# Altium schematic sheet Cycle-Controller-Onboard.SchDoc: RespiraWorks
size A3; CompanyName: RespiraWorks; DrawnBy: E. Chiu; Organization: Altium; DocumentNumber: 4; Revision: A1; SheetNumber: 4; SheetTotal: 8; PageSetup: Record=PageOptions|CenterHorizontal=True|CenterVertical=True|PrintScale=0.67|XCorrection=1.00|YCorrection=1.00|PrintKind=0|BorderSize=5000000|LeftOffset=0|BottomOffset=0|Orientation=2|PaperLength=1000|PaperWidth=1000|Scale=100|PaperSource=276|PrintQuality=-3|MediaType=1|DitherType=10|PrintScaleMode=1|PaperKind=11"x17" 279.4x431.8mm|PaperIndex=3; ProjectName: FALCON 3S
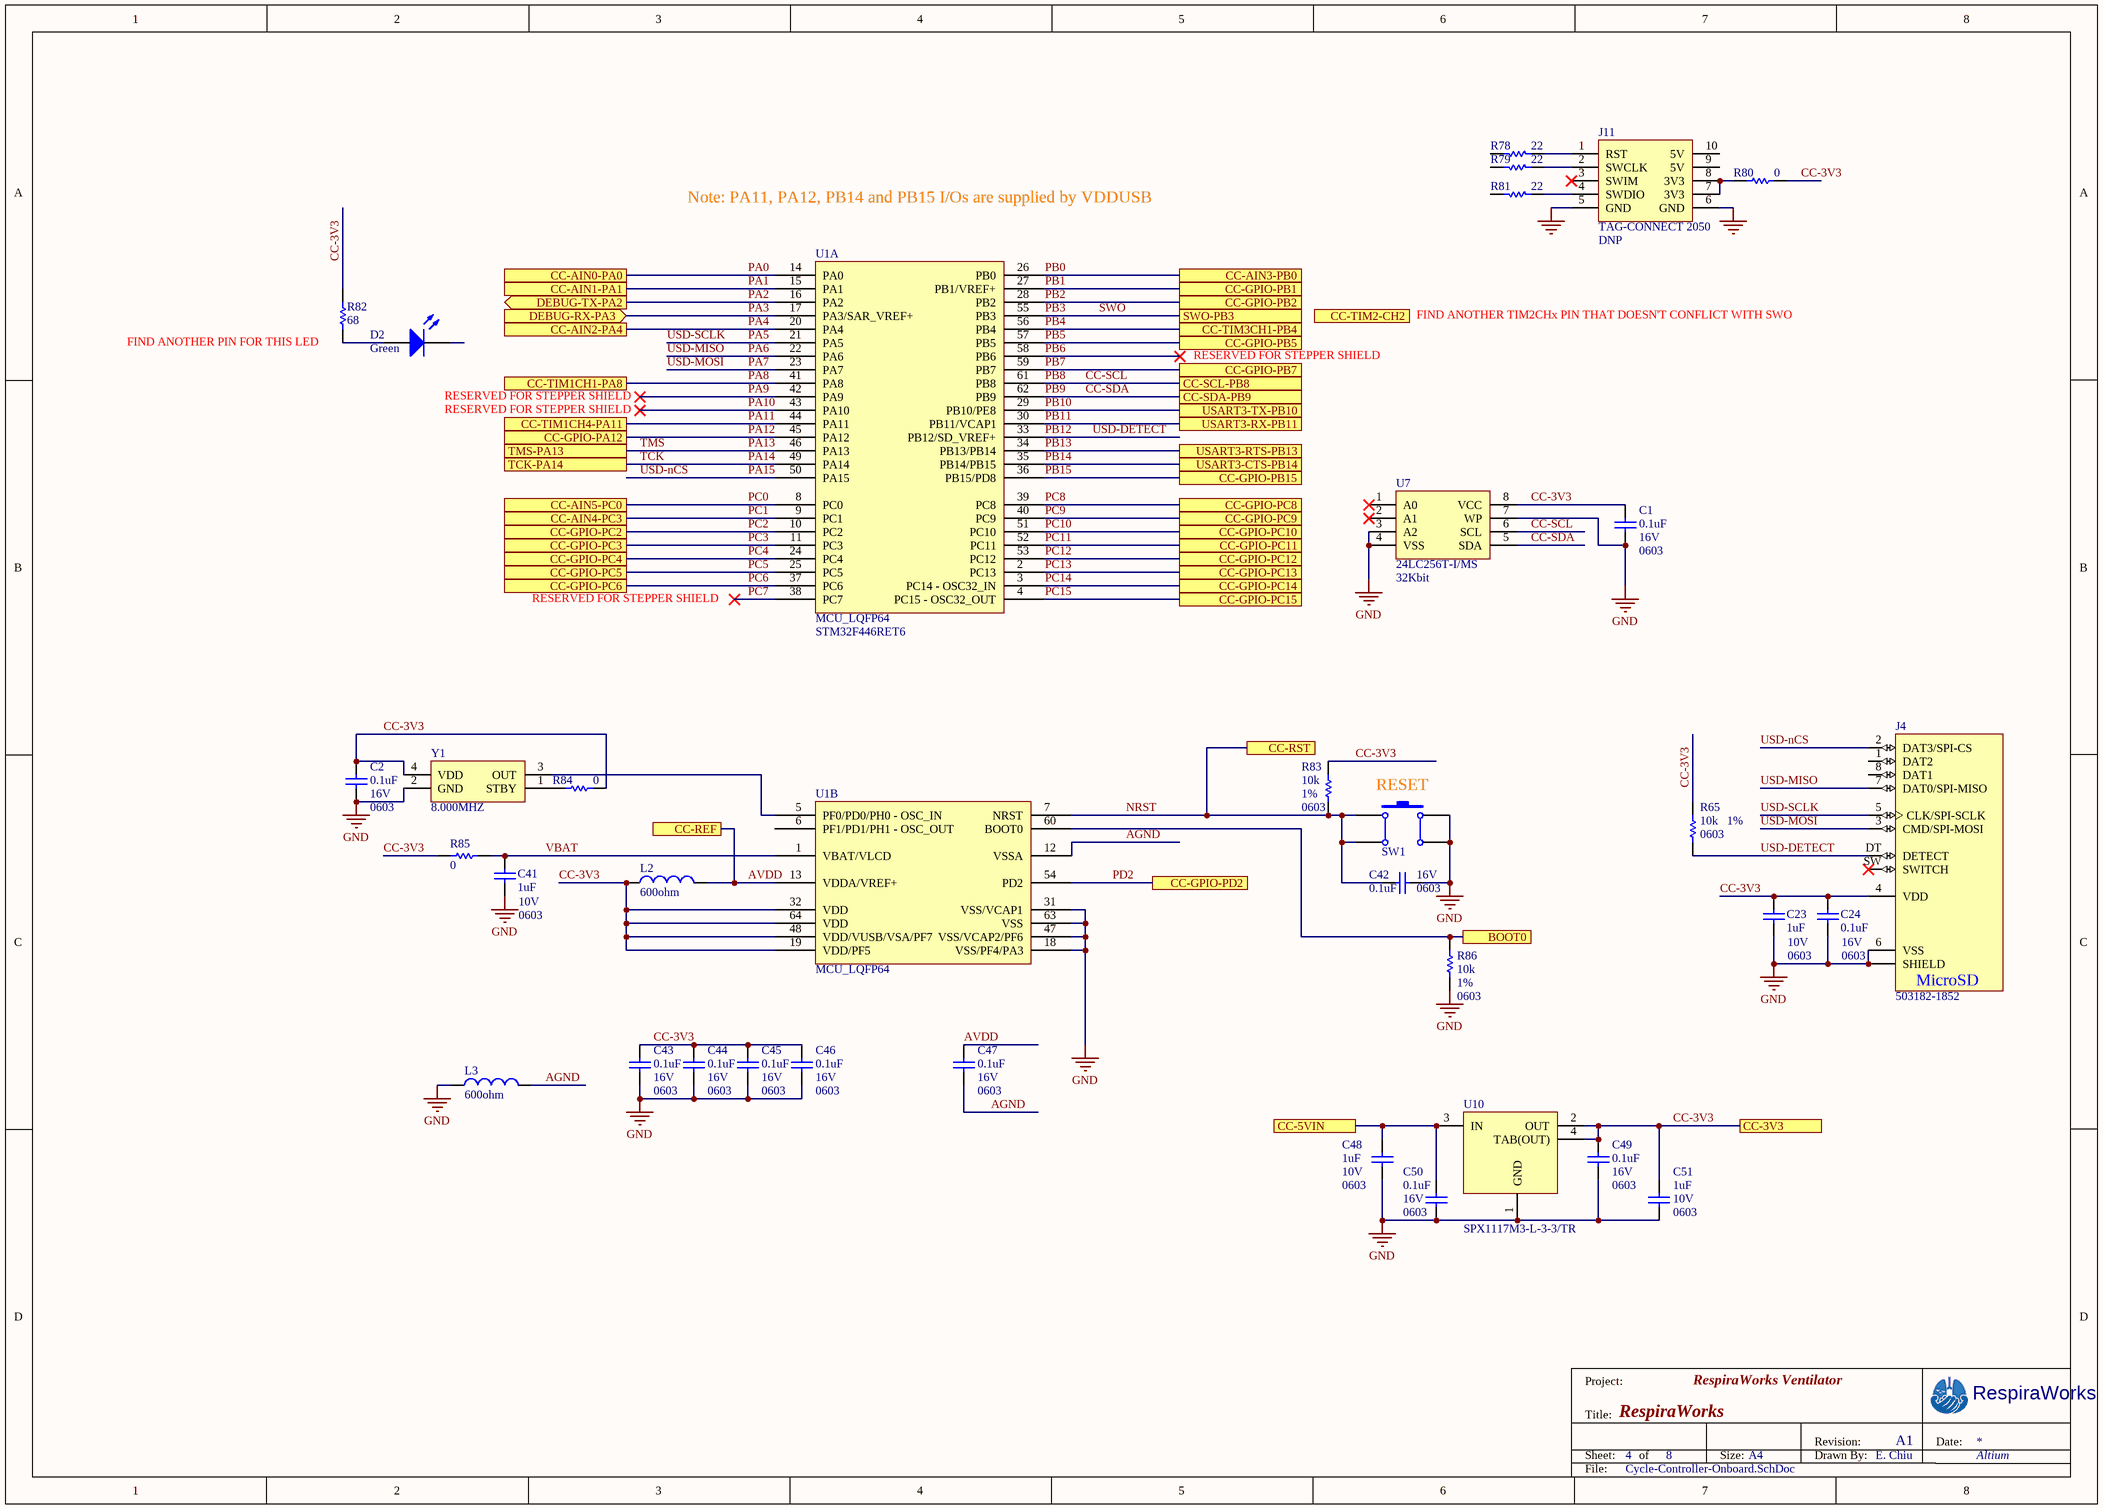
[diagram p0: Cycle-Controller-Onboard.SchDoc]

## Parts
C1  value 0.1uF  Voltage: 16V  PCB Package: 0603  [CAP0603]  (hidden comment: CAP 0603)
C2  value 0.1uF  Voltage: 16V  PCB Package: 0603  [CAP0603]  (hidden comment: CAP 0603)
C23  value 1uF  Voltage: 10V  PCB Package: 0603  [CAP0603]  (hidden comment: CAP 0603)
C24  value 0.1uF  Voltage: 16V  PCB Package: 0603  [CAP0603]  (hidden comment: CAP 0603)
C41  value 1uF  Voltage: 10V  PCB Package: 0603  [CAP0603]  (hidden comment: CAP 0603)
C42  value 0.1uF  Voltage: 16V  PCB Package: 0603  [CAP0603]  (hidden comment: CAP 0603)
C43  value 0.1uF  Voltage: 16V  PCB Package: 0603  [CAP0603]  (hidden comment: CAP 0603)
C44  value 0.1uF  Voltage: 16V  PCB Package: 0603  [CAP0603]  (hidden comment: CAP 0603)
C45  value 0.1uF  Voltage: 16V  PCB Package: 0603  [CAP0603]  (hidden comment: CAP 0603)
C46  value 0.1uF  Voltage: 16V  PCB Package: 0603  [CAP0603]  (hidden comment: CAP 0603)
C47  value 0.1uF  Voltage: 16V  PCB Package: 0603  [CAP0603]  (hidden comment: CAP 0603)
C48  value 1uF  Voltage: 10V  PCB Package: 0603  [CAP0603]  (hidden comment: CAP 0603)
C49  value 0.1uF  Voltage: 16V  PCB Package: 0603  [CAP0603]  (hidden comment: CAP 0603)
C50  value 0.1uF  Voltage: 16V  PCB Package: 0603  [CAP0603]  (hidden comment: CAP 0603)
C51  value 1uF  Voltage: 10V  PCB Package: 0603  [CAP0603]  (hidden comment: CAP 0603)
D2  value Green  [LED0603]  (hidden comment: LED 0603)
J4  503182-1852  [503182-1852]
J11  TAG-CONNECT 2050  Do Not Populate: DNP  [TAG-CONNECT-2050]
L2  value 600ohm  [IND0603]  (hidden comment: BEAD)
L3  value 600ohm  [IND0603]  (hidden comment: BEAD)
R65  value 10k  PCB Package: 0603  Tolerance: 1%  [RES0603]  (hidden comment: RES 0603)
R78  value 22  [RES0603]  (hidden comment: RES 0603)
R79  value 22  [RES0603]  (hidden comment: RES 0603)
R80  value 0  [RES0603]  (hidden comment: RES 0603)
R81  value 22  [RES0603]  (hidden comment: RES 0603)
R82  value 68  [RES0603]  (hidden comment: RES 0603)
R83  value 10k  PCB Package: 0603  Tolerance: 1%  [RES0603]  (hidden comment: RES 0603)
R84  value 0  [RES0603]  (hidden comment: RES 0603)
R85  value 0  [RES0603]  (hidden comment: RES 0603)
R86  value 10k  PCB Package: 0603  Tolerance: 1%  [RES0603]  (hidden comment: RES 0603)
SW1  BUTTON  [PB-6MM-J-LEAD]  (value not drawn)
U1  MCU_LQFP64  Manufacturer P/N: STM32F446RET6  [64-LQFP]  (parts A,B of 2)
U7  value 32Kbit  [8-MSOP]  (hidden comment: 256Kbit)
U10  Manufacturer P/N: SPX1117M3-L-3-3/TR  [3-SOT223]  (hidden comment: NCP1117ST33T3G)
Y1  8.000MHZ  [4-OSC3225]

## Ports
BOOT0, CC-3V3, CC-5VIN, CC-AIN0-PA0, CC-AIN1-PA1, CC-AIN2-PA4, CC-AIN3-PB0, CC-AIN4-PC3, CC-AIN5-PC0, CC-GPIO-PA12, CC-GPIO-PB1, CC-GPIO-PB2, CC-GPIO-PB5, CC-GPIO-PB7, CC-GPIO-PB15, CC-GPIO-PC2, CC-GPIO-PC3, CC-GPIO-PC4, CC-GPIO-PC5, CC-GPIO-PC6, CC-GPIO-PC8, CC-GPIO-PC9, CC-GPIO-PC10, CC-GPIO-PC11, CC-GPIO-PC12, CC-GPIO-PC13, CC-GPIO-PC14, CC-GPIO-PC15, CC-GPIO-PD2, CC-REF, CC-RST, CC-SCL-PB8, CC-SDA-PB9, CC-TIM1CH1-PA8, CC-TIM1CH4-PA11, CC-TIM2-CH2, CC-TIM3CH1-PB4, DEBUG-RX-PA3 (in), DEBUG-TX-PA2 (out), SWO-PB3, TCK-PA14, TMS-PA13, USART3-CTS-PB14, USART3-RTS-PB13, USART3-RX-PB11, USART3-TX-PB10

## Nets
GND: C1.2 C2.2 C23.2 C24.2 C41.2 C42.2 C43.2 C44.2 C45.2 C46.2 C48.2 C49.2 C50.2 C51.2 J4.6(VSS) J4.P1(SHIELD) J4.P2(SHIELD) J4.P3(SHIELD) J4.P4(SHIELD) J4.P5(SHIELD) J11.5(GND) J11.6(GND) L3.1 R86.1 SW1.3 SW1.4 U1.18(VSS/PF4/PA3) U1.31(VSS/VCAP1) U1.47(VSS/VCAP2/PF6) U1.63(VSS) U7.3(A2) U7.4(VSS) U7.7(WP) U10.1(GND) Y1.2(GND)
AGND: C47.2 L3.2 U1.12(VSSA)
AVDD: C47.1 L2.2 U1.13(VDDA/VREF+) ; port CC-REF
BOOT0: R86.2 U1.60(BOOT0) ; port BOOT0
CC-3V3: C1.1 C2.1 C23.1 C24.1 C43.1 C44.1 C45.1 C46.1 C49.1 C51.1 J4.4(VDD) L2.1 R65.2 R80.2 R82.2 R83.2 R84.1 R85.2 U1.19(VDD/PF5) U1.32(VDD) U1.48(VDD/VUSB/VSA/PF7) U1.64(VDD) U7.8(VCC) U10.2(OUT) U10.4(TAB(OUT)) Y1.4(VDD) ; port CC-3V3
CC-5VIN: C48.1 C50.1 U10.3(IN) ; port CC-5VIN
CC-SCL: U1.61(PB8) U7.6(SCL) ; port CC-SCL-PB8  [also labelled PB8]
CC-SDA: U1.62(PB9) U7.5(SDA) ; port CC-SDA-PB9  [also labelled PB9]
NRST: C42.1 R83.1 SW1.1 SW1.2 U1.7(NRST) ; port CC-RST
PA0: U1.14(PA0) ; port CC-AIN0-PA0
PA1: U1.15(PA1) ; port CC-AIN1-PA1
PA2: U1.16(PA2) ; port DEBUG-TX-PA2
PA3: U1.17(PA3/SAR_VREF+) ; port DEBUG-RX-PA3
PA4: U1.20(PA4) ; port CC-AIN2-PA4
PA5: J4.5(CLK/SPI-SCLK) U1.21(PA5)  [also labelled USD-SCLK]
PA6: J4.7(DAT0/SPI-MISO) U1.22(PA6)  [also labelled USD-MISO]
PA7: J4.3(CMD/SPI-MOSI) U1.23(PA7)  [also labelled USD-MOSI]
PA8: U1.41(PA8) ; port CC-TIM1CH1-PA8
PA9: U1.42(PA9)
PA10: U1.43(PA10)
PA11: U1.44(PA11) ; port CC-TIM1CH4-PA11
PA12: U1.45(PA12) ; port CC-GPIO-PA12
PA13: U1.46(PA13) ; port TMS-PA13  [also labelled TMS]
PA14: U1.49(PA14) ; port TCK-PA14  [also labelled TCK]
PA15: J4.2(DAT3/SPI-CS) U1.50(PA15)  [also labelled USD-nCS]
PB0: U1.26(PB0) ; port CC-AIN3-PB0
PB1: U1.27(PB1/VREF+) ; port CC-GPIO-PB1
PB2: U1.28(PB2) ; port CC-GPIO-PB2
PB3: U1.55(PB3) ; port SWO-PB3  [also labelled SWO]
PB4: U1.56(PB4) ; port CC-TIM3CH1-PB4
PB5: U1.57(PB5) ; port CC-GPIO-PB5
PB6: U1.58(PB6)
PB7: U1.59(PB7) ; port CC-GPIO-PB7
PB10: U1.29(PB10/PE8) ; port USART3-TX-PB10
PB11: U1.30(PB11/VCAP1) ; port USART3-RX-PB11
PB12: J4.DT(DETECT) R65.1 U1.33(PB12/SD_VREF+)  [also labelled USD-DETECT]
PB13: U1.34(PB13/PB14) ; port USART3-RTS-PB13
PB14: U1.35(PB14/PB15) ; port USART3-CTS-PB14
PB15: U1.36(PB15/PD8) ; port CC-GPIO-PB15
PC0: U1.8(PC0) ; port CC-AIN5-PC0
PC1: U1.9(PC1) ; port CC-AIN4-PC3
PC2: U1.10(PC2) ; port CC-GPIO-PC2
PC3: U1.11(PC3) ; port CC-GPIO-PC3
PC4: U1.24(PC4) ; port CC-GPIO-PC4
PC5: U1.25(PC5) ; port CC-GPIO-PC5
PC6: U1.37(PC6) ; port CC-GPIO-PC6
PC7: U1.38(PC7)
PC8: U1.39(PC8) ; port CC-GPIO-PC8
PC9: U1.40(PC9) ; port CC-GPIO-PC9
PC10: U1.51(PC10) ; port CC-GPIO-PC10
PC11: U1.52(PC11) ; port CC-GPIO-PC11
PC12: U1.53(PC12) ; port CC-GPIO-PC12
PC13: U1.2(PC13) ; port CC-GPIO-PC13
PC14: U1.3(PC14_-_OSC32_IN) ; port CC-GPIO-PC14
PC15: U1.4(PC15_-_OSC32_OUT) ; port CC-GPIO-PC15
PD2: U1.54(PD2) ; port CC-GPIO-PD2
VBAT: C41.1 R85.1 U1.1(VBAT/VLCD)
NetD2_A: D2.A R82.1
NetJ11_1: J11.1(RST) R78.1
NetJ11_2: J11.2(SWCLK) R79.1
NetJ11_4: J11.4(SWDIO) R81.1
NetJ11_7: J11.7(3V3) J11.8(3V3) R80.1
NetR84_2: R84.2 Y1.1(STBY)
NetU1_5: U1.5(PF0/PD0/PH0_-_OSC_IN) Y1.3(OUT)

Not connected (* = marked no-connect by the designer): D2 K; J4 1(DAT2) 8(DAT1) SW(SWITCH)*; J11 3(SWIM)* 9(5V) 10(5V); R78 2; R79 2; R81 2; U1 6(PF1/PD1/PH1_-_OSC_OUT); U7 1(A0)* 2(A1)*

## Notes on the sheet
- Note: PA11, PA12, PB14 and PB15 I/Os are supplied by VDDUSB
- FIND ANOTHER TIM2CHx PIN THAT DOESN'T CONFLICT WITH SWO
- (near R82) FIND ANOTHER PIN FOR THIS LED
- RESERVED FOR STEPPER SHIELD
- (near D2) RESERVED FOR STEPPER SHIELD
- (near SW1) RESET
- Project:
- RespiraWorks Ventilator
- Title:
- Sheet:
- of
- Size:
- A4
- Drawn By:
- Revision:
- Date:
- File:
- (in symbol 503182-1852) MicroSD

## Library data of the parts
C1 C2 C24 C42-C47 C49 C50 = CAP 0603: Manufacturer P/N: CC0603KRX7R7BB104; Manufacturer: Yageo; Type: X7R; Do Not Populate: *
C23 C41 C48 C51 = CAP 0603: Manufacturer P/N: CC0603KRX7R6BB105; Manufacturer: Yageo; Type: X7R; Do Not Populate: *
D2 = LED 0603: Manufacturer P/N: LTST-C191KGKT; Manufacturer: Lite-On; PCB Package: 0603; Vf: 2V; Intensity: 35mcd@20mA; Color: Green; Do Not Populate: *
J4 = 503182-1852: 10 _8 + 2_ Position Card Connector microSD Surface Mount, Right Angle Gold; Manufacturer: Molex; Manufacturer P/N: 5031821852; Digi-Key_Part_Number: WM12834CT-ND; Digi-Key_Purchase_URL: https://www.digikey.com.tr/product-detail/en/molex/5031821852/WM12834CT-ND/5823232?utm_source=snapeda&utm_medium=aggregator&utm_campaign=symbol; SnapEDA_Link: https://www.snapeda.com/parts/5031821852/Molex/view-part/46835/?ref=snap; Value: *; Package: None
J11 = TC-2050-STLINK: 10-pin TAG-CONNECT Bed of Nails footprint; Manufacturer P/N: 2050; Manufacturer: TAG-CONNECT; PCB Package: 2050; Tolerance: *; Value: *
L2 L3 = FERRITE 0603: Manufacturer P/N: 742792651; Manufacturer: Wurth; PCB Package: 0603; Tolerance: *; Do Not Populate: *
R65 R83 R86 = RES 0603: Manufacturer P/N: ERJ-3EKF1002V; Manufacturer: Panasonic; Do Not Populate: *
R78 R79 R81 = RES 0603: Manufacturer P/N: RC0603FR-0722RL; Manufacturer: Yageo; PCB Package: 0603; Tolerance: 1%; Do Not Populate: *
R80 R84 = RES 0603: Manufacturer P/N: ERJ-3GEY0R00V; Manufacturer: Panasonic; PCB Package: 0603; Tolerance: *; Do Not Populate: *
R82 = RES 0603: Manufacturer P/N: ERJ-3EKF68R0V; Manufacturer: Panasonic; PCB Package: 0603; Tolerance: 1%; Do Not Populate: *
R85 = RES 0603: Manufacturer P/N: ERJ-3GEY0R00V; Manufacturer: Panasonic; PCB Package: 0603; Do Not Populate: DNP; Tolerance: *
SW1 = PUSHBUTTON-SQ-6MM-TACT-J-LEAD: PUSHBUTTON, 6MM SQ, TACT, J-Lead; Manufacturer P/N: TL3301AF160QJ; Manufacturer: E-Switch; PCB Package: PB-6MM-J-LEAD; Tolerance: *; Do Not Populate: *; Value: *
U1 = MCU_LQFP64: IC MCU 32BIT 512KB FLASH 64LQFP; Manufacturer: ST Micro; PCB Package: 64-LQFP
U7 = 24LC256T-I/MS: IC EEPROM 256KBIT I2C 400KHZ 8MSOP; Manufacturer: Microchip; Tolerance: 25ppm; PCB Package: 8-MSOP; Do Not Populate: *; Manufacturer P/N: 24LC256T-I/MS
U10 = NCP1117ST33T3G: LDO, 3.3V out, 1A, 20V in, SOT-223, 0.8W Pd max; Manufacturer: Exar; PCB Package: SOT223; Do Not Populate: *
Y1 = ASEMB-8.000MHZ-LC-T: OSC MEMS 8.000MHZ CMOS SMD; Manufacturer: Abracon; PCB Package: 3225; Tolerance: 50ppm; Manufacturer P/N: ASEMB-8.000MHZ-LC-T; Do Not Populate: *; Value: 8.000MHZ